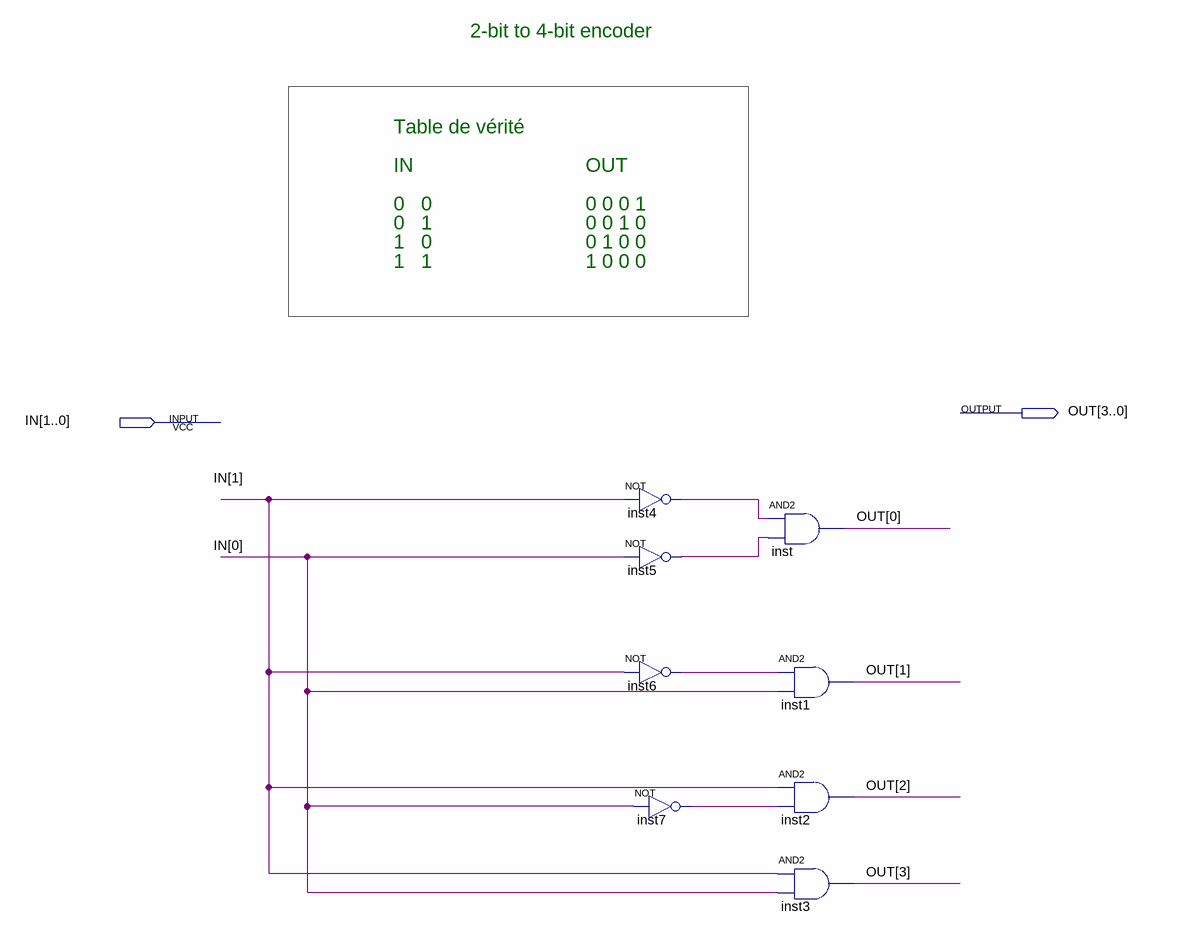
[diagram p0: schematic sheet]
// Quartus schematic 2b4_encoder.bdf as structural Verilog: 8 symbols, 2 pins
module \2b4_encoder  (
  input  [1:0] IN,
  output [3:0] OUT
);

  wire inst4_out, inst5_out, inst6_out, inst7_out;

  not inst4 (inst4_out, IN[1]);
  not inst5 (inst5_out, IN[0]);
  not inst6 (inst6_out, IN[1]);
  not inst7 (inst7_out, IN[0]);
  and inst (OUT[0], inst4_out, inst5_out);
  and inst1 (OUT[1], inst6_out, IN[0]);
  and inst2 (OUT[2], IN[1], inst7_out);
  and inst3 (OUT[3], IN[1], IN[0]);

  // Notes on the sheet:
  //   2-bit to 4-bit encoder   
  //   Table de vérité 
  //   IN
  //   OUT
  //   0   0
  //   0 0 0 1
  //   0   1
  //   0 0 1 0
  //   1   0
  //   0 1 0 0
  //   1   1
  //   1 0 0 0
endmodule
